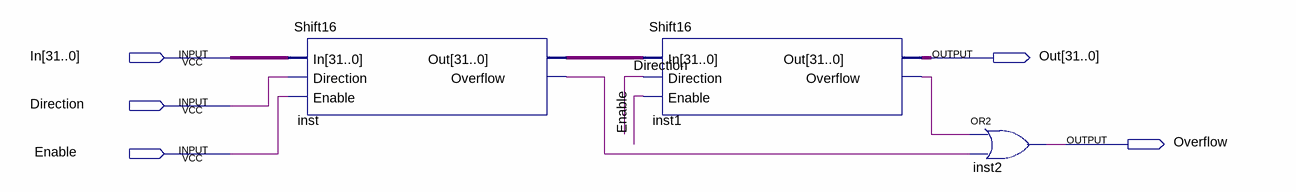
[diagram p0: schematic sheet]
// Quartus schematic Shift32.bdf as structural Verilog: 3 symbols, 5 pins
module Shift32 (
  input  [31:0] In,
  input  Direction,
  input  Enable,
  output [31:0] Out,
  output Overflow
);

  wire inst1_overflow, inst_overflow;
  wire [31:0] inst_out;

  Shift16 inst (.In(In), .Direction(Direction), .Enable(Enable), .Out(inst_out), .Overflow(inst_overflow));
  Shift16 inst1 (.In(inst_out), .Direction(Direction), .Enable(Enable), .Out(Out), .Overflow(inst1_overflow));
  or inst2 (Overflow, inst1_overflow, inst_overflow);
endmodule
